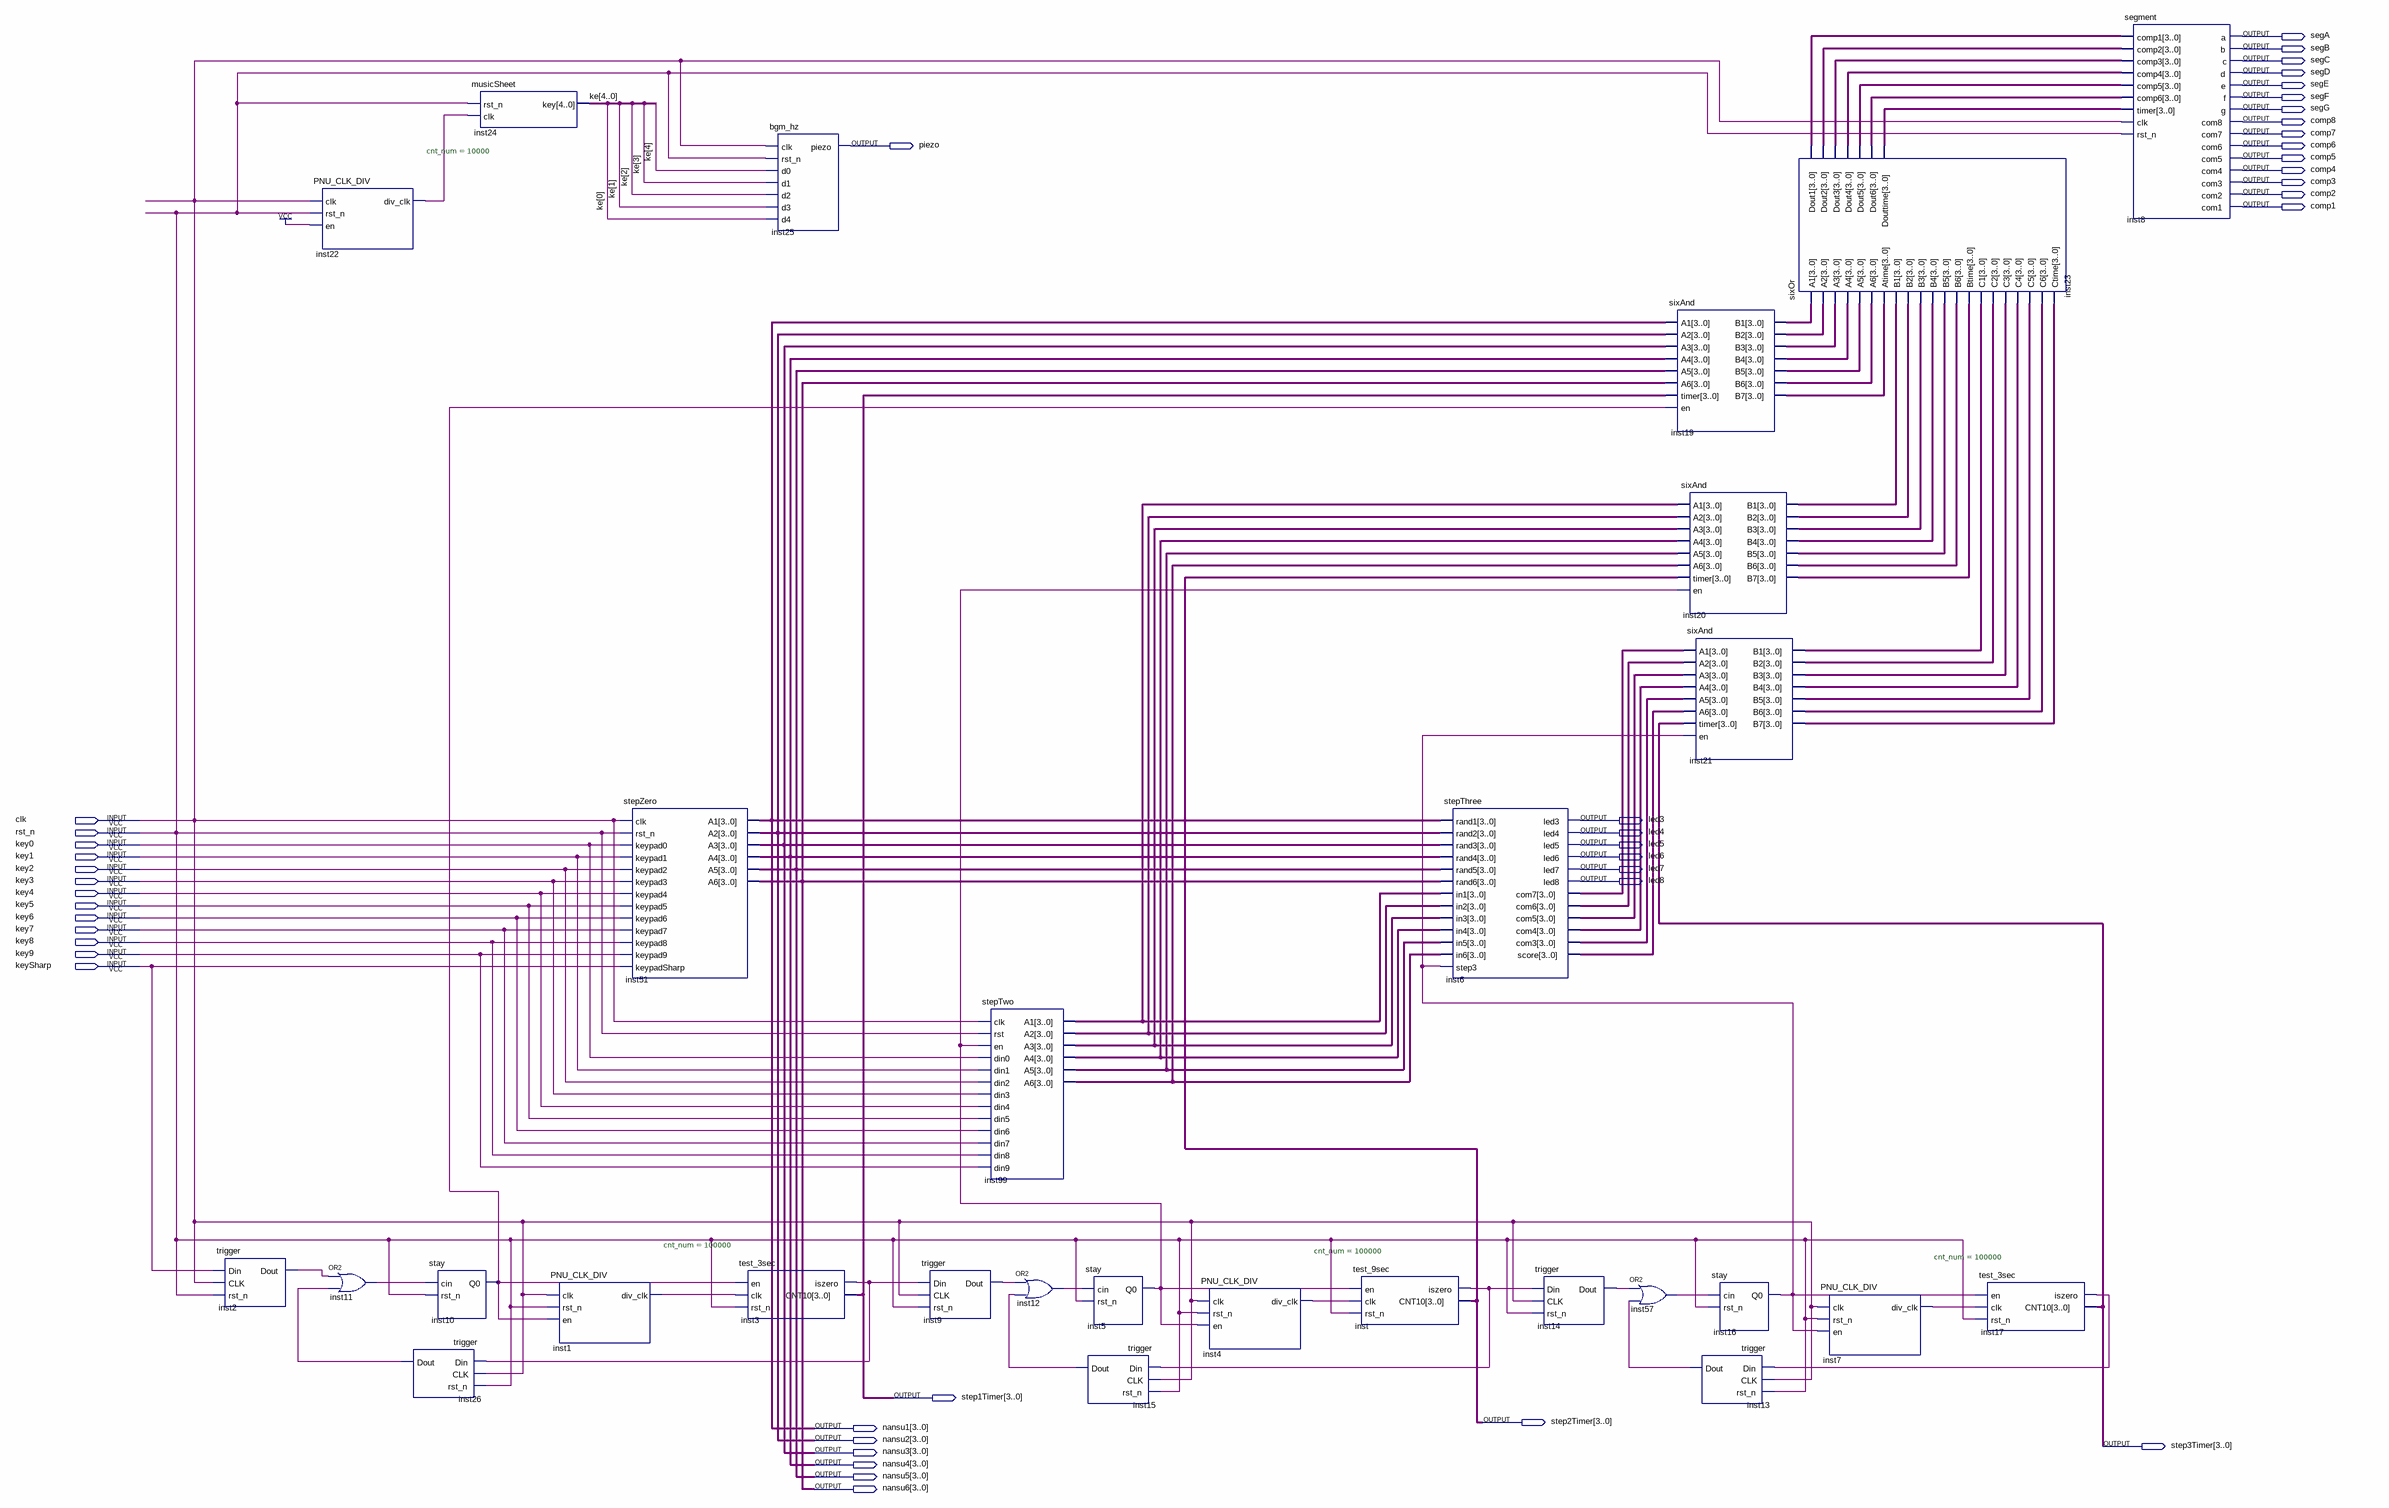
[diagram p0: schematic sheet]
// Quartus schematic game.bdf as structural Verilog: 29 symbols, 44 pins
module game (
  input  clk,
  input  rst_n,
  input  key0,
  input  key1,
  input  key2,
  input  key3,
  input  key4,
  input  key5,
  input  key6,
  input  key7,
  input  key8,
  input  key9,
  input  keySharp,
  output segA,
  output segB,
  output segC,
  output segD,
  output segE,
  output segF,
  output segG,
  output comp8,
  output comp7,
  output piezo,
  output comp6,
  output comp5,
  output comp4,
  output comp3,
  output comp2,
  output comp1,
  output led3,
  output led4,
  output led5,
  output led6,
  output led7,
  output led8,
  output [3:0] step1Timer,
  output [3:0] step2Timer,
  output [3:0] nansu1,
  output [3:0] nansu2,
  output [3:0] step3Timer,
  output [3:0] nansu3,
  output [3:0] nansu4,
  output [3:0] nansu5,
  output [3:0] nansu6
);

  wire inst1_div_clk, inst2_dout, inst3_iszero, inst4_div_clk, inst5_q0, inst7_div_clk, inst9_dout,
       inst10_q0, inst11_out, inst12_out, inst13_dout, inst14_dout, inst15_dout, inst16_q0, inst17_iszero,
       inst22_div_clk, inst26_dout, inst57_out, inst_iszero;
  wire [3:0] inst6_com3, inst6_com4, inst6_com5, inst6_com6, inst6_com7, inst6_score, inst19_b1, inst19_b2,
       inst19_b3, inst19_b4, inst19_b5, inst19_b6, inst19_b7, inst20_b1, inst20_b2, inst20_b3, inst20_b4,
       inst20_b5, inst20_b6, inst20_b7, inst21_b1, inst21_b2, inst21_b3, inst21_b4, inst21_b5, inst21_b6,
       inst21_b7, inst23_dout1, inst23_dout2, inst23_dout3, inst23_dout4, inst23_dout5, inst23_dout6,
       inst23_douttime, inst99_a1, inst99_a2, inst99_a3, inst99_a4, inst99_a5, inst99_a6;
  wire [4:0] ke;

  trigger inst2 (.Din(keySharp), .CLK(clk), .rst_n(rst_n), .Dout(inst2_dout));
  PNU_CLK_DIV #(.cnt_num(10000)) inst22 (.clk(clk), .rst_n(rst_n), .en(1'b1), .div_clk(inst22_div_clk));
  or inst11 (inst11_out, inst2_dout, inst26_dout);
  stay inst10 (.cin(inst11_out), .rst_n(rst_n), .Q0(inst10_q0));
  trigger inst26 (.Din(inst3_iszero), .CLK(clk), .rst_n(rst_n), .Dout(inst26_dout));
  musicSheet inst24 (.rst_n(rst_n), .clk(inst22_div_clk), .key(ke));
  PNU_CLK_DIV #(.cnt_num(100000)) inst1 (.clk(clk), .rst_n(rst_n), .en(inst10_q0), .div_clk(inst1_div_clk));
  stepZero inst51 (
    .clk(clk), .rst_n(rst_n), .keypad0(key0), .keypad1(key1), .keypad2(key2), .keypad3(key3), .keypad4(key4),
    .keypad5(key5), .keypad6(key6), .keypad7(key7), .keypad8(key8), .keypad9(key9), .keypadSharp(keySharp),
    .A1(nansu1), .A2(nansu2), .A3(nansu3), .A4(nansu4), .A5(nansu5), .A6(nansu6));
  bgm_hz inst25 (.clk(clk), .rst_n(rst_n), .d0(ke[4]), .d1(ke[3]), .d2(ke[2]), .d3(ke[1]), .d4(ke[0]), .piezo(piezo));
  test_3sec inst3 (.en(inst10_q0), .clk(inst1_div_clk), .rst_n(rst_n), .iszero(inst3_iszero), .CNT10(step1Timer));
  trigger inst9 (.Din(inst3_iszero), .CLK(clk), .rst_n(rst_n), .Dout(inst9_dout));
  stepTwo inst99 (
    .clk(clk), .rst(rst_n), .en(inst5_q0), .din0(key0), .din1(key1), .din2(key2), .din3(key3), .din4(key4),
    .din5(key5), .din6(key6), .din7(key7), .din8(key8), .din9(key9), .A1(inst99_a1), .A2(inst99_a2),
    .A3(inst99_a3), .A4(inst99_a4), .A5(inst99_a5), .A6(inst99_a6));
  or inst12 (inst12_out, inst9_dout, inst15_dout);
  stay inst5 (.cin(inst12_out), .rst_n(rst_n), .Q0(inst5_q0));
  trigger inst15 (.Din(inst_iszero), .CLK(clk), .rst_n(rst_n), .Dout(inst15_dout));
  PNU_CLK_DIV #(.cnt_num(100000)) inst4 (.clk(clk), .rst_n(rst_n), .en(inst5_q0), .div_clk(inst4_div_clk));
  test_9sec inst (.en(inst5_q0), .clk(inst4_div_clk), .rst_n(rst_n), .iszero(inst_iszero), .CNT10(step2Timer));
  stepThree inst6 (
    .rand1(nansu1), .rand2(nansu2), .rand3(nansu3), .rand4(nansu4), .rand5(nansu5), .rand6(nansu6),
    .in1(inst99_a1), .in2(inst99_a2), .in3(inst99_a3), .in4(inst99_a4), .in5(inst99_a5), .in6(inst99_a6),
    .step3(inst16_q0), .led3(led3), .led4(led4), .led5(led5), .led6(led6), .led7(led7), .led8(led8),
    .com7(inst6_com7), .com6(inst6_com6), .com5(inst6_com5), .com4(inst6_com4), .com3(inst6_com3),
    .score(inst6_score));
  trigger inst14 (.Din(inst_iszero), .CLK(clk), .rst_n(rst_n), .Dout(inst14_dout));
  or inst57 (inst57_out, inst14_dout, inst13_dout);
  sixAnd inst19 (
    .A1(nansu1), .A2(nansu2), .A3(nansu3), .A4(nansu4), .A5(nansu5), .A6(nansu6), .timer(step1Timer),
    .en(inst10_q0), .B1(inst19_b1), .B2(inst19_b2), .B3(inst19_b3), .B4(inst19_b4), .B5(inst19_b5),
    .B6(inst19_b6), .B7(inst19_b7));
  sixAnd inst20 (
    .A1(inst99_a1), .A2(inst99_a2), .A3(inst99_a3), .A4(inst99_a4), .A5(inst99_a5), .A6(inst99_a6),
    .timer(step2Timer), .en(inst5_q0), .B1(inst20_b1), .B2(inst20_b2), .B3(inst20_b3), .B4(inst20_b4),
    .B5(inst20_b5), .B6(inst20_b6), .B7(inst20_b7));
  sixAnd inst21 (
    .A1(inst6_com7), .A2(inst6_com6), .A3(inst6_com5), .A4(inst6_com4), .A5(inst6_com3), .A6(inst6_score),
    .timer(step3Timer), .en(inst16_q0), .B1(inst21_b1), .B2(inst21_b2), .B3(inst21_b3), .B4(inst21_b4),
    .B5(inst21_b5), .B6(inst21_b6), .B7(inst21_b7));
  trigger inst13 (.Din(inst17_iszero), .CLK(clk), .rst_n(rst_n), .Dout(inst13_dout));
  stay inst16 (.cin(inst57_out), .rst_n(rst_n), .Q0(inst16_q0));
  sixOr inst23 (
    .A1(inst19_b1), .A2(inst19_b2), .A3(inst19_b3), .A4(inst19_b4), .A5(inst19_b5), .A6(inst19_b6),
    .Atime(inst19_b7), .B1(inst20_b1), .B2(inst20_b2), .B3(inst20_b3), .B4(inst20_b4), .B5(inst20_b5),
    .B6(inst20_b6), .Btime(inst20_b7), .C1(inst21_b1), .C2(inst21_b2), .C3(inst21_b3), .C4(inst21_b4),
    .C5(inst21_b5), .C6(inst21_b6), .Ctime(inst21_b7), .Dout1(inst23_dout1), .Dout2(inst23_dout2),
    .Dout3(inst23_dout3), .Dout4(inst23_dout4), .Dout5(inst23_dout5), .Dout6(inst23_dout6),
    .Douttime(inst23_douttime));
  PNU_CLK_DIV #(.cnt_num(100000)) inst7 (.clk(clk), .rst_n(rst_n), .en(inst16_q0), .div_clk(inst7_div_clk));
  test_3sec inst17 (.en(inst16_q0), .clk(inst7_div_clk), .rst_n(rst_n), .iszero(inst17_iszero), .CNT10(step3Timer));
  segment inst8 (
    .comp1(inst23_dout1), .comp2(inst23_dout2), .comp3(inst23_dout3), .comp4(inst23_dout4),
    .comp5(inst23_dout5), .comp6(inst23_dout6), .timer(inst23_douttime), .clk(clk), .rst_n(rst_n), .a(segA),
    .b(segB), .c(segC), .d(segD), .e(segE), .f(segF), .g(segG), .com8(comp8), .com7(comp7), .com6(comp6),
    .com5(comp5), .com4(comp4), .com3(comp3), .com2(comp2), .com1(comp1));
endmodule
